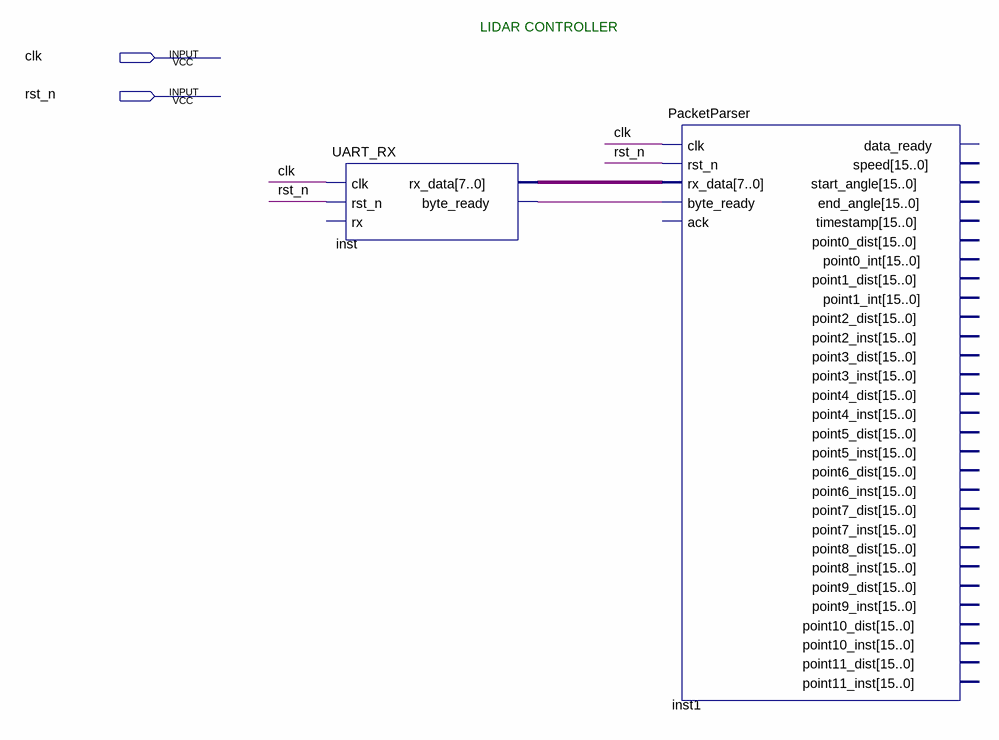
[diagram p0: schematic sheet]
// Quartus schematic LidarController.bdf as structural Verilog: 2 symbols, 2 pins
module LidarController (
  input  clk,
  input  rst_n
);

  wire inst_byte_ready;
  wire [7:0] inst_rx_data;

  UART_RX inst (.clk(clk), .rst_n(rst_n), .rx_data(inst_rx_data), .byte_ready(inst_byte_ready));  // open: rx
  PacketParser inst1 (
    .clk(clk), .rst_n(rst_n), .rx_data(inst_rx_data), .byte_ready(inst_byte_ready));  // open: ack, data_ready, speed, start_angle, end_angle, timestamp, point0_dist, point0_int, point1_dist, point1_int, point2_dist, point2_inst, point3_dist, point3_inst, point4_dist, point4_inst, point5_dist, point5_inst, point6_dist, point6_inst, point7_dist, point7_inst, point8_dist, point8_inst, point9_dist, point9_inst, point10_dist, point10_inst, point11_dist, point11_inst

  // Notes on the sheet:
  //   LIDAR CONTROLLER
endmodule
